# Altium project FuelCell.PrjPcb (part 3 of 3)

## Sheet Power.SchDoc: POWER
size A4; ApprovedBy: ANBI; CheckedBy: ANBI; Author: SEOKIPO; CompanyName: SY 동아퓨얼셀; DrawnBy: SEOKIPO; Engineer: SEOKIPO; Revision: 001; SheetNumber: 6; SheetTotal: 6
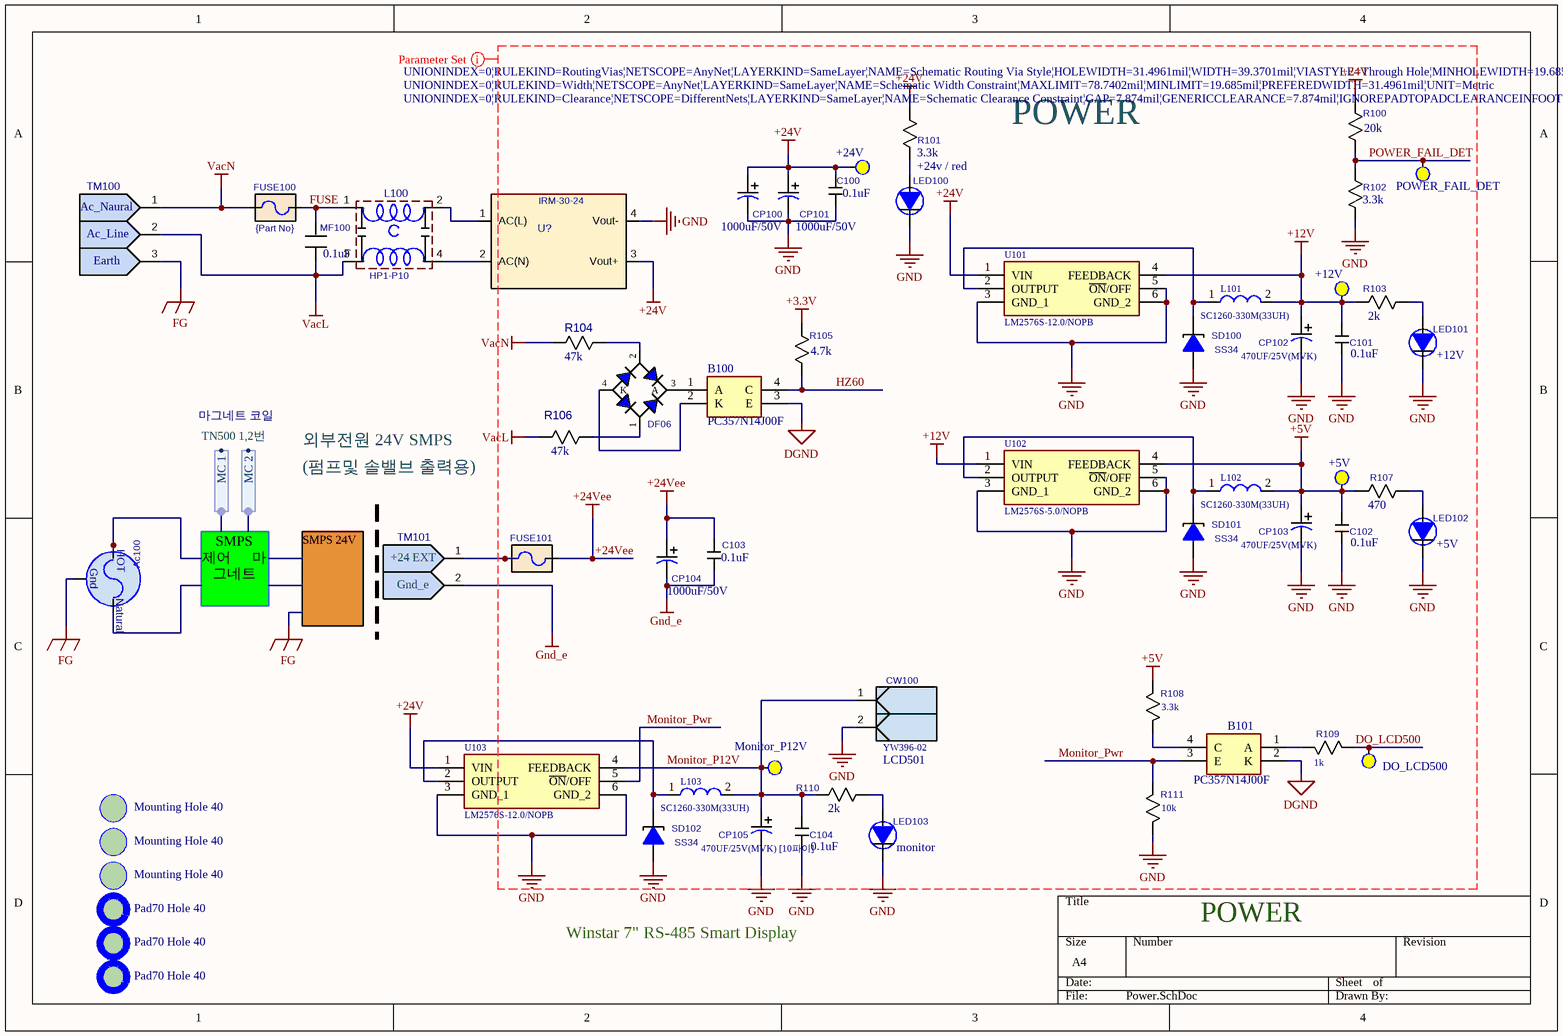
[diagram p13: Power.SchDoc]

### Parts
+5V  Test Point_top  [TP_KEYSTONE_5000]  (value not drawn)
+12V  Test Point_top  [TP_KEYSTONE_5000]  (value not drawn)
+24V  Test Point_top  [TP_KEYSTONE_5000]  (value not drawn)
Ac100  ac2  (value not drawn)
B100  PC357N14J00F  [SOP254P675X300-4N]
B101  PC357N14J00F  [SOP254P675X300-4N]
BD100  Part No.: DF06  [DF-S]  (hidden comment: DF06S)
C100  규격: 0.1uF  [CC2012]  (hidden comment: CS2012)
C101  규격: 0.1uF  [CC2012]  (hidden comment: CS2012)
C102  규격: 0.1uF  [CC2012]  (hidden comment: CS2012)
C103  규격: 0.1uF  [CC2012]  (hidden comment: CS2012)
C104  규격: 0.1uF  [CC2012]  (hidden comment: CS2012)
CP100  규격: 1000uF/50V  [CP5_12]  (hidden comment: CP5_12)
CP101  규격: 1000uF/50V  [CP5_12]  (hidden comment: CP5_12)
CP102  규격: 470UF/25V(MVK)  [CP10_SMT]  (hidden comment: CP10_SMT)
CP103  규격: 470UF/25V(MVK)  [CP10_SMT]  (hidden comment: CP10_SMT)
CP104  규격: 1000uF/50V  [CP5_12]  (hidden comment: CP5_12)
CP105  규격: 470UF/25V(MVK) [10파이]  [CP10_SMT]  (hidden comment: CP10_SMT)
CW100  BOP No.: LCD501  [YW396_02]  (hidden comment: YW396-02)
DO_LCD500  Test Point_top  [TP_KEYSTONE_5000]  (value not drawn)
FUSE100  Part No.: {Part No}  [FUSE_HOLD_S]  (hidden comment: FUSE_CASE)
FUSE101  FUSE_CASE  [FUSE_HOLD_S]  (value not drawn)
Hole100  Mounting Hole 40  [HOLE40]
Hole101  Mounting Hole 40  [HOLE40]
Hole103  Mounting Hole 40  [HOLE40]
Hole104  Pad70 Hole 40  [pad70h45]
Hole105  Pad70 Hole 40  [pad70h45]
Hole?  Pad70 Hole 40  [pad70h45]
L100  Part No.: HP1-P10  [NF_HP1]  (hidden comment: NF_HP1)
L101  Part No.: SC1260-330M(33UH)  [SC1260S]  (hidden comment: SC1260)
L102  Part No.: SC1260-330M(33UH)  [SC1260S]  (hidden comment: SC1260)
L103  Part No.: SC1260-330M(33UH)  [SC1260S]  (hidden comment: SC1260)
LED100  Name: +24v / red  [LED1608]  (hidden comment: LED1608)
LED101  Name: +12V  [LED1608]  (hidden comment: LED1608)
LED102  Name: +5V  [LED1608]  (hidden comment: LED1608)
LED103  Name: monitor  [LED1608]  (hidden comment: LED1608)
MF100  규격: 0.1uF  [MF_104_Filkor]  (hidden comment: MF104_FLIKO)
Monitor_P12V  Test Point_top  [TP_KEYSTONE_5000]  (value not drawn)
POWER_FAIL_DET  Test Point_top  [TP_KEYSTONE_5000]  (value not drawn)
R100  규격: 20k  [RESC1608X55N]  (hidden comment: R1608)
R101  규격: 3.3k  [RESC1608X55N]  (hidden comment: R1608)
R102  규격: 3.3k  [RESC1608X55N]  (hidden comment: R1608)
R103  규격: 2k  [RESC1608X55N]  (hidden comment: R1608)
R104  규격: 47k  [R3216]  (hidden comment: R3216)
R105  규격: 4.7k  [RESC1608X55N]  (hidden comment: R1608)
R106  규격: 47k  [R3216]  (hidden comment: R3216)
R107  규격: 470  [RESC1608X55N]  (hidden comment: R1608)
R108  규격: 3.3k  [RESC1608X55N]  (hidden comment: R1608)
R109  규격: 1k  [RESC1608X55N]  (hidden comment: R1608)
R110  규격: 2k  [RESC1608X55N]  (hidden comment: R1608)
R111  규격: 10k  [RESC1608X55N]  (hidden comment: R1608)
SD100  Part No.: SS34  [D5025]  (hidden comment: SK_SMT)
SD101  Part No.: SS34  [D5025]  (hidden comment: SK_SMT)
SD102  Part No.: SS34  [D5025]  (hidden comment: SK_SMT)
TM100  TERMINAL-2PIN  [TERMINAL_10_3]  (value not drawn)
TM101  TERMINAL-2PIN  [TERMINAL_10_2]  (value not drawn)
U101  Part No.: LM2576S-12.0/NOPB  [KTT0005B]  (hidden comment: LM2576S-5.0_NOPB)
U102  Part No.: LM2576S-5.0/NOPB  [KTT0005B]  (hidden comment: LM2576S-5.0_NOPB)
U103  Part No.: LM2576S-12.0/NOPB  [KTT0005B]  (hidden comment: SC1260-330M(33UH))
U?  AC2DC 24V_1200mA  (value not drawn)

### Harnesses
마그네트 코일: MC 1
?: MC 2

### Nets
+3.3V: R105.1
+5V: +5V.1(tp) C102.2 CP103.2 L102.2 R107.1 R108.2 U102.4(FEEDBACK)
+12V: +12V.1(tp) C101.2 CP102.2 L101.2 R103.1 U101.4(FEEDBACK) U102.1(VIN)
+24V: +24V.1(tp) C100.2 CP100.2 CP101.2 R100.1 R101.1 U101.1(VIN) U103.1(VIN) U?.3(Vout+)
+24Vee: C103.2 CP104.2 FUSE101.2
DGND: B100.3(E) B101.2(K)
FG: Ac100.3(GND) TM100.3
GND: C100.1 C101.1 C102.1 C104.1 CP100.1 CP101.1 CP102.1 CP103.1 CP105.1 CW100.2 LED100.2 LED101.2 LED102.2 LED103.2 R102.2 R111.2 SD100.1 SD101.1 SD102.1 U101.3(GND_1) U101.5(~{ON}/OFF) U101.6(GND_2) U102.3(GND_1) U102.5(~{ON}/OFF) U102.6(GND_2) U103.3(GND_1) U103.6(GND_2) U?.4(Vout-)
Gnd_e: C103.1 CP104.1 TM101.2
VacL: L100.3 MF100.2 R106.1 TM100.2
VacN: FUSE100.1 R104.1 TM100.1
DO_LCD500: DO_LCD500.1(tp) R109.1
FUSE: FUSE100.2 L100.1 MF100.1
HZ60: B100.4(C) R105.2
Monitor_P12V: C104.2 CP105.2 CW100.1 L103.2 Monitor_P12V.1(tp) R110.1 U103.4(FEEDBACK)
Monitor_Pwr: B101.3(E) R111.1 U103.5(~{ON}/OFF)
POWER_FAIL_DET: POWER_FAIL_DET.1(tp) R100.2 R102.1
NetB100_1: B100.1(A) BD100.3(A)
NetB100_2: B100.2(K) BD100.4(K)
NetB101_1: B101.1(A) R109.2
NetB101_4: B101.4(C) R108.1
NetBD100_1: BD100.1(C) R106.2
NetBD100_2: BD100.2(C) R104.2
NetFUSE101_1: FUSE101.1 TM101.1
NetL100_2: L100.2 U?.1(AC(L))
NetL100_4: L100.4 U?.2(AC(N))
NetL101_1: L101.1 SD100.2 U101.2(OUTPUT)
NetL102_1: L102.1 SD101.2 U102.2(OUTPUT)
NetL103_1: L103.1 SD102.2 U103.2(OUTPUT)
NetLED100_1: LED100.1 R101.2
NetLED101_1: LED101.1 R103.2
NetLED102_1: LED102.1 R107.2
NetLED103_1: LED103.1 R110.2

Not connected (* = marked no-connect by the designer): Ac100 1 2; Hole100 1; Hole101 1; Hole103 1; Hole104 1; Hole105 1; Hole? 1

### Layout directives
rule Clearance Constraint [Clearance = 0.2mm]; rule Width Constraint [Pref Width = 0.8mm    Min Width = 0.5mm    Max Width = 2mm]; rule Routing Via Style [Pref Size = 1mm    Pref Hole Size = 0.8mm]: +3.3V, +5V, +12V, +24V, +24Vee, DGND, DO_LCD500, GND, Gnd_e, HZ60, Monitor_P12V, Monitor_Pwr, POWER_FAIL_DET, VacL, VacN

### Notes on the sheet
- POWER
- (near TM100) Ac_Naural
- (near TM100) Ac_Line
- (near TM100) Earth
- TN500 1,2번
- 외부전원 24V SMPS
- (펌프및 솔밸브 출력용)
- (near TM101) +24 EXT
- SMPS        제어      마그네트
- SMPS 24V
- (near TM101) Gnd_e
- Winstar 7" RS-485 Smart Display
- (in symbol AC_gnd) HOT; Gnd; Natural

### Library data of the parts
+5V +12V +24V DO_LCD500 Monitor_P12V POWER_FAIL_DET = Tp_5000: Pad30; Part No.: *
Ac100 = AC_gnd: Part No.: *
B100 B101 = PC357N14J00F: Integrated Circuit; Part No.: PC357N14J00F; Price: 81; Height: 3mm
BD100 = DF06S: Full Wave Diode Bridge; ComponentField6: Published 8-Jun-2000; OriginalName: BRIDGE; Price: 60
C100-C104 = CS2012: Part No.: C2012X7R1H104KT  (CC20X104K50W); Price: 6
CP100 CP101 CP104 = CP5_12: Part No.: {Part No}; Price: 205
CP102 CP103 CP105 = CP10_SMT: Part No.: CHIP 전해 470UF/25V(MVK) [10파이]; Price: 130
FUSE101 = FUSE_CASE: Part No.: 4527; Price: 1000
Hole100 Hole101 Hole103 = HOLE40: Part No.: *
Hole104 Hole105 Hole? = PAD70h45: Part No.: *
L101 L102 = SC1260: Inductor; Manufacturer_Name: TDK; Manufacturer_Part_Number: VLP8040T-100M; Mouser Part Number: 810-VLP8040T-100M; Mouser Price/Stock: https://www.mouser.co.uk/ProductDetail/TDK/VLP8040T-100M?qs=uxmvvYJjMIsKO4pNbUQWxA%3D%3D; Arrow Price/Stock: https://www.arrow.com/en/products/vlp8040t-100m/tdk; Datasheet Link: https://componentsearchengine.com/Datasheets/2/VLP8040T-100M.pdf; Height: 4mm; Price: 240
L103 = SC1260: Inductor; Manufacturer_Part_Number: VLP8040T-100M; Height: 4mm; Price: 240
LED100 LED102 = LED1608: Part No.: BL-HUF35A-AV-TRB; Price: {Price}
LED101 LED103 = LED1608: Part No.: {Part No}; Price: {Price}
MF100 = MF104_FLIKO: Part No.: {Part No}; Price: {Price}
R100 R109 R111 = R1608: Part No.: {Part No}; Price: {Price}
R101 R102 R108 = R1608: Part No.: WR06X332JT(3.3KR)J; Price: 1.0
R103 R110 = R1608: Part No.: WR06X202JT(2KR)J; Price: 1
R104 R106 = R3216: Part No.: WR12X473JT(47KR)J; Price: 1
R105 = R1608: Part No.: WR06X472JT(4.7KR)J; Price: 1
R107 = R1608: Part No.: WR06X471JT(470R)J; Price: 1.0
SD100-SD102 = SK_SMT: 규격: 3A; Price: 46
TM100 = TERMINAL-3P: Part No.: HP-1000SA-3pin; Price: 390
TM101 = TERMINAL-2P: Part No.: HP-1000SA-2pin; Price: 260
U101-U103 = LM2576S-5.0_NOPB: Integrated Circuit; Price: 485
  U101 U103: Arrow Part Number: LM2576S-12.0/NOPB
  U102: Arrow Part Number: LM2576S-5.0/NOPB
U? = IRM-30-24: {Price}: Price; Part No.: IRM-30-24
CW100 = YW396-02: Price: 20; Part No.: YW396-02
FUSE100 = FUSE_CASE: Price: {Price}
L100 = NF_HP1: Price: {Price}

## Nets that join several sheets
+3.3V: Output_Section (7 pins), TempController (C307.2 IC301.8), Input_Section (6 pins), Mcu (29 pins), Power (R105.1)
+3.3V_ANA: TempController (18 pins), Mcu (IC5.33)
+5V: Output_Section (8 pins), TempController (5 pins), Input_Section (9 pins), Mcu (C2.2 CP2.2 IC1.3), Ethernet (C204.2 CP201.2 IC200.3), Power (7 pins)
+24V: Output_Section (D512.2 R557.2 R558.2 U517.8), Power (9 pins)
+24Vee: Output_Section (88 pins), Input_Section (22 pins), Power (C103.2 CP104.2 FUSE101.2)
AGND: Output_Section (15 pins), TempController (30 pins), Input_Section (40 pins), Mcu (IC5.34 L2.1 L3.1), Ethernet (17 pins)
DGND: Output_Section (30 pins), TempController (C307.1 IC301.14), Input_Section (8 pins), Mcu (39 pins), Ethernet (18 pins), Power (B100.3 B101.2)
FG: Output_Section (8 pins), Mcu (D1.3), Ethernet (6 pins), Power (Ac100.3 TM100.3)
GND: Output_Section (Q500.2), Mcu (L1.1), Power (28 pins)
Gnd_e: Output_Section (83 pins), Input_Section (61 pins), Mcu (R1.1 R2.1 R3.1), Power (C103.1 CP104.1 TM101.2)
VacL: Output_Section (33 pins), Power (L100.3 MF100.2 R106.1 TM100.2)
VacN: Output_Section (9 pins), Power (FUSE100.1 R104.1 TM100.1)
485_A: Input_Section (CW401.1 CW403.1 CW405.2), Mcu (D1.2 IC4.6 R7.2 R11.1)
485_B: Input_Section (CW401.2 CW403.2 CW405.3), Mcu (D1.1 IC4.7 R7.1 R8.1)
DAC_CS: Output_Section (IC501.3), Mcu (IC5.75)
DI_FAN504: Input_Section (B400.4 R411.1 Tp405.1), Mcu (IC5.24)
DI_FD176: Input_Section (B405.4 R448.1 Tp418.1), Mcu (IC5.89)
DI_FIRE: Output_Section (CW527.2), Input_Section (R449.1 R451.1)
DI_GD501: Input_Section (B401.4 R418.1 Tp408.1), Mcu (IC5.59)
DI_GD502: Input_Section (B402.4 R425.1 Tp411.1), Mcu (IC5.60)
DI_HT193_WD: Output_Section (B513.4 R562.2 Tp518.1), Mcu (IC5.78)
DI_HT194_WD: Output_Section (B516.4 R572.2 Tp523.1), Mcu (IC5.80)
DI_HT195_WD: Output_Section (B519.4 R581.2 Tp528.1), Mcu (IC5.82)
DI_HT196_WD: Output_Section (B522.4 R591.2 Tp532.1), Mcu (IC5.84)
DI_SPARE1: Input_Section (B404.4 R440.1 Tp415.1), Mcu (IC5.45)
DI_SPARE_WD: Output_Section (B525.4 R603.2 Tp537.1), Mcu (IC5.46)
DI_TJ_SIG: Input_Section (B403.4 R433.1 Tp413.1), Mcu (IC5.44)
DO_FAN504: Output_Section (R600.1 Tp535.1), Mcu (IC5.25)
DO_HT193: Output_Section (R568.1 Tp520.1), Mcu (IC5.77)
DO_HT194: Output_Section (R578.1 Tp526.1), Mcu (IC5.79)
DO_HT195: Output_Section (R587.1 Tp531.1), Mcu (IC5.81)
DO_HT196: Output_Section (R599.1 Tp534.1), Mcu (IC5.83)
DO_HT_SPEAR1: Output_Section (R612.1 Tp539.1), Mcu (IC5.85)
DO_IGN175: Output_Section (R598.1 Tp533.1), Mcu (IC5.73)
DO_LCD500: Mcu (IC5.62), Power (DO_LCD500.1 R109.1)
DO_MC_SW: Output_Section (R559.1 Tp514.1), Mcu (IC5.76)
DO_MV124: Output_Section (R570.1 Tp521.1), Mcu (IC5.94)
DO_MV131: Output_Section (R579.1 Tp525.1), Mcu (IC5.91)
DO_MV148: Output_Section (R545.1 Tp509.1), Mcu (IC5.97)
DO_MV150: Output_Section (R554.1 Tp512.1), Mcu (IC5.96)
DO_MV155: Output_Section (R510.1 Tp501.1), Mcu (IC5.16)
DO_MV158: Output_Section (R561.1 Tp515.1), Mcu (IC5.95)
DO_MV300: Output_Section (R523.1 Tp503.1), Mcu (IC5.15)
DO_MV390: Output_Section (R533.1 Tp505.1), Mcu (IC5.98)
DO_MV_SPARE: Output_Section (R588.1 Tp530.1), Mcu (IC5.90)
DO_SV102: Output_Section (R505.1 Tp500.1), Mcu (IC5.18)
DO_SV103: Output_Section (R514.1 Tp502.1), Mcu (IC5.19)
DO_SV125: Output_Section (R543.1 Tp508.1), Mcu (IC5.22)
DO_SV145: Output_Section (R526.1 Tp504.1), Mcu (IC5.20)
DO_SV149: Output_Section (R550.1 Tp511.1), Mcu (IC5.23)
DO_SV323: Output_Section (R535.1 Tp506.1), Mcu (IC5.21)
DO_SV_SPARE: Output_Section (R614.1 Tp540.1), Mcu (IC5.17)
DO_TRI: Output_Section (R608.1 Tp538.1), Mcu (IC5.86)
ETH1_INT: Mcu (IC5.3), Ethernet (IC201.36)
ETH1_RSTN: Mcu (IC5.2), Ethernet (ETH1_RSTN.1 IC201.37)
ETH1_SCSN: Mcu (IC5.7), Ethernet (IC201.32)
ETH2_INT: Mcu (IC5.100), Ethernet (IC202.36)
ETH2_RSTN: Mcu (IC5.99), Ethernet (ETH2_RSTN.1 IC202.37)
ETH2_SCSN: Mcu (IC5.1), Ethernet (IC202.32)
ETH_MISO: Mcu (IC5.4), Ethernet (IC201.35 IC202.35)
ETH_MOSI: Mcu (IC5.5), Ethernet (IC201.34 IC202.34)
ETH_SCLK: Mcu (IC5.6), Ethernet (IC201.33 IC202.33)
FAN_ERR: Output_Section (CW528.2), Input_Section (B400.2)
HZ60: Mcu (IC5.51), Power (B100.4 R105.2)
I2C_SCL: Input_Section (5 pins), Mcu (IC5.42 IC6.16 R12.1)
I2C_SDA: Input_Section (5 pins), Mcu (IC5.43 IC6.15 R13.1)
PAO_MFC111: Output_Section (D509.2 R531.1), Input_Section (CW406.2)
PAO_MFC121: Output_Section (D509.1 R538.1), Input_Section (CW408.2)
POWER_FAIL_DET: Mcu (IC5.74), Power (POWER_FAIL_DET.1 R100.2 R102.1)
TC_ADDR0: TempController (7 pins), Mcu (IC5.26)
TC_ADDR1: TempController (7 pins), Mcu (IC5.27)
TC_ADDR2: TempController (7 pins), Mcu (IC5.28)
TC_ADDR3: TempController (7 pins), Mcu (IC5.29)
TC_AMB_1: TempController (R302.1), Input_Section (IC402.4)
TC_EN1: TempController (IC300.18 IC303.18), Mcu (IC5.32)
TC_EN2: TempController (IC305.18 IC307.18), Mcu (IC5.31)
TC_EN3: TempController (IC306.18 IC308.18), Mcu (IC5.35)
TC_SPI_CLK: Output_Section (IC501.4), TempController (IC301.10), Mcu (IC5.56)
TC_SPI_CS: TempController (IC301.9), Mcu (IC5.57)
TC_SPI_MISO: Output_Section (IC501.19), TempController (IC301.11), Mcu (IC5.54)
TC_SPI_MOSI: Output_Section (IC501.5), TempController (IC301.12), Mcu (IC5.53)